# EAGLE design industrialPrototype (EAGLE 7.4.0)
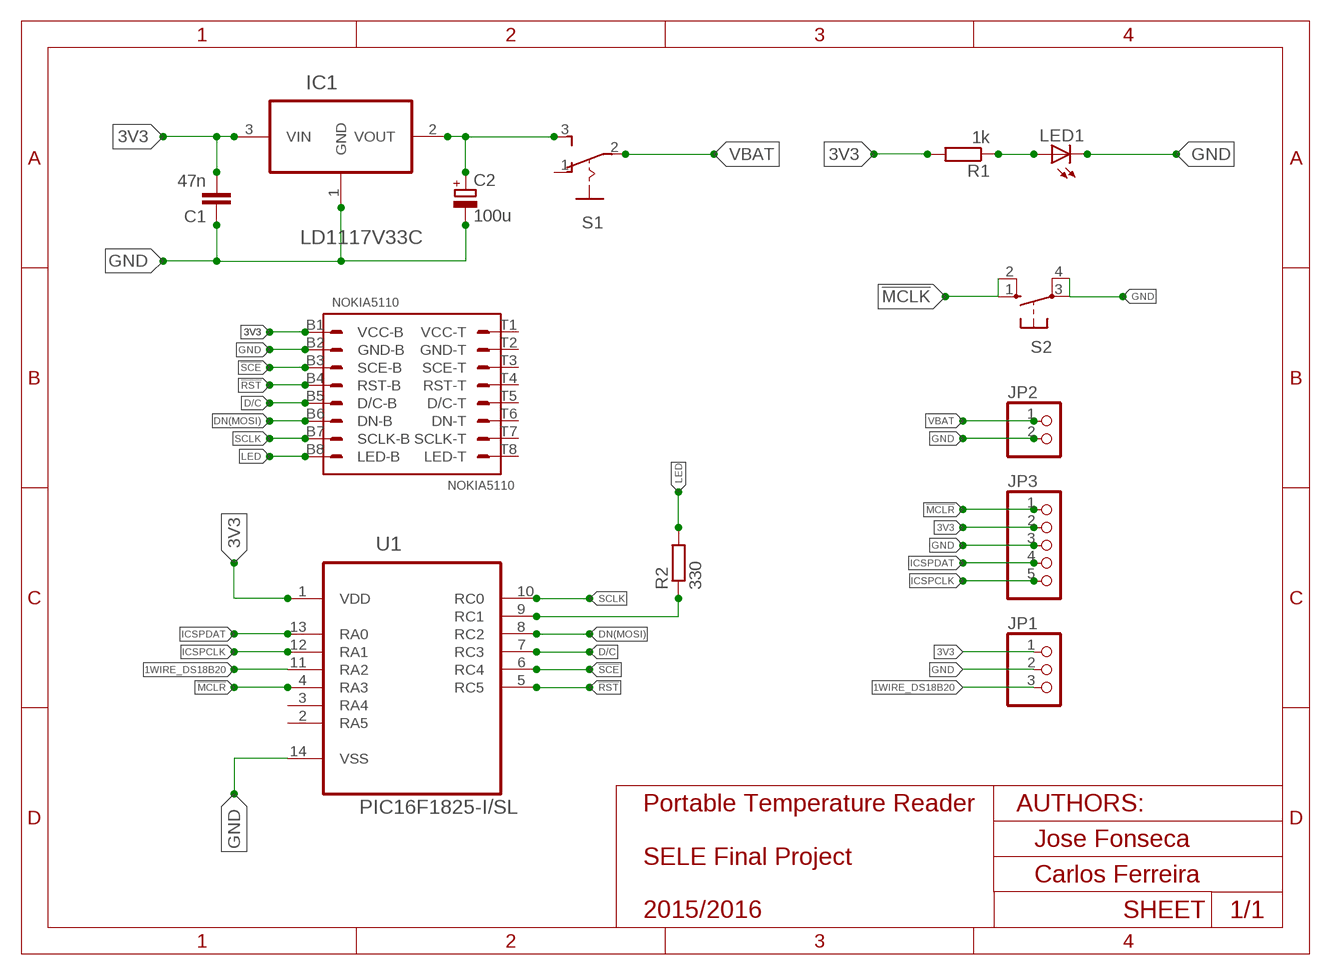
[diagram p0: schematic, sheet 1]

## Parts
C1  47n  C-EU025-025X050  [C025-025X050]
C2  100u  CPOL-EUE2.5-6  [E2,5-6]
IC1  LD1117V33C  [TO254P482X1024X3124-3P]
JP1  PINHD-1X3  [1X03]
JP2  PINHD-1X2  [1X02]
JP3  PINHD-1X5  [1X05]
LED1  LED3MM  [LED3MM]
NOKIA5110  NOKIA5110  [NOKIA5110]
R1  1k  R-EU_0204/5  [0204/5]
R2  330  R-EU_0204/5  [0204/5]
S1  255SB  [255SB]
S2  10-XX  [B3F-10XX]
U1  PIC16F1825-I/SL  [SOIC127P600X175-14N]

## Nets
1WIRE_DS18B20: JP1.3 U1.11(RA2)
3V3: C1.2 IC1.3(VIN) JP1.1 JP3.2 NOKIA5110.B1(VCC-B) R1.2 U1.1(VDD)
!MCLK!: S2.1(S) S2.2(S1)
!MCLR!: JP3.1 U1.4(RA3)
!RST!: NOKIA5110.B4(RST-B) U1.5(RC5)
!SCE!: NOKIA5110.B3(SCE-B) U1.6(RC4)
D/C: NOKIA5110.B5(D/C-B) U1.7(RC3)
DN(MOSI): NOKIA5110.B6(DN-B) U1.8(RC2)
GND: C1.1 C2.- IC1.1(GND) JP1.2 JP2.2 JP3.3 LED1.K(C) NOKIA5110.B2(GND-B) S2.3(P) S2.4(P1) U1.14(VSS)
ICSPCLK: JP3.5 U1.12(RA1)
ICSPDAT: JP3.4 U1.13(RA0)
LED: NOKIA5110.B8(LED-B) R2.2
N$1: LED1.A R1.1
N$3: R2.1 U1.9(RC1)
SCLK: NOKIA5110.B7(SCLK-B) U1.10(RC0)
VBAT: C2.+ IC1.2(VOUT) JP2.1 S1.2(P) S1.3(S)
Unconnected: NOKIA5110.T1(VCC-T) NOKIA5110.T2(GND-T) NOKIA5110.T3(SCE-T) NOKIA5110.T4(RST-T) NOKIA5110.T5(D/C-T) NOKIA5110.T6(DN-T) NOKIA5110.T7(SCLK-T) NOKIA5110.T8(LED-T) S1.1(O) U1.2(RA5) U1.3(RA4)

## Library data of the parts
C1 = rcl:C-EU: CAPACITOR, European symbol
C2 = rcl:CPOL-EU: POLARIZED CAPACITOR, European symbol
IC1 = ld1117:LD1117V33C: IC, V REG, LD1117 3.3V, TO-220-3; MPN: LD1117V33C; OC_FARNELL: 1703357; OC_NEWARK: 89K0631; PACKAGE: TO-220-3; SUPPLIER: STMicroelectronics
JP1 = pinhead:PINHD-1X3: PIN HEADER
JP2 = pinhead:PINHD-1X2: PIN HEADER
JP3 = pinhead:PINHD-1X5: PIN HEADER
LED1 = led:LED: LED OSRAM: - CHIPLED LG R971, LG N971, LY N971, LG Q971, LY Q971, LO R971, LY R971 LH N974, LH R974 LS Q976, LO Q976, LY Q976 LO Q996 - Hyper CHIPLED LW Q18S LB Q993, LB Q99A, LB R99A - SideLED LS A670, LO A670, LY A670, LG A670, LP A670 LB A673, LV A673, LT A673, LW A673 LH A674 LY A675 LS A676, LA A676, LO A676, LY A676, LW A676 LS A679, LY A679, LG A679 - Hyper Micro SIDELED® LS Y876, LA Y876, LO Y876, LY Y876 LT Y87S - SmartLED LW L88C, LW L88S LB L89C, LB L89S, LG L890 LS L89K, LO L89K, LY L89K LS L896, LA L896, LO L896, LY L896 - TOPLED LS T670, LO T670, LY T670, LG T670, LP T670 LSG T670, LSP T670, LSY T670, LOP T670, LYG T670 LG T671, LOG T671, LSG T671 LB T673, LV T673, LT T673, LW T673 LH T674 LS T676, LA T676, LO T676, LY T676, LB T676, LH T676, LSB T676, LW T676 LB T67C, LV T67C, LT T67C, LS T67K, LO T67K, LY T67K, LW E67C LS E67B, LA E67B, LO E67B, LY E67B, LB E67C, LV E67C, LT E67C LW T67C LS T679, LY T679, LG T679 LS T770, LO T770, LY T770, LG T770, LP T770 LB T773, LV T773, LT T773, LW T773 LH T774 LS E675, LA E675, LY E675, LS T675 LS T776, LA T776, LO T776, LY T776, LB T776 LHGB T686 LT T68C, LB T68C - Hyper Mini TOPLED® LB M676 - Mini TOPLED Santana® LG M470 LS M47K, LO M47K, LY M47K Source: http://www.osram.convergy.de LUXEON: - LUMILED® LXK2-PW12-R00, LXK2-PW12-S00, LXK2-PW14-U00, LXK2-PW14-V00 LXK2-PM12-R00, LXK2-PM12-S00, LXK2-PM14-U00 LXK2-PE12-Q00, LXK2-PE12-R00, LXK2-PE12-S00, LXK2-PE14-T00, LXK2-PE14-U00 LXK2-PB12-K00, LXK2-PB12-L00, LXK2-PB12-M00, LXK2-PB14-N00, LXK2-PB14-P00, LXK2-PB14-Q00 LXK2-PR12-L00, LXK2-PR12-M00, LXK2-PR14-Q00, LXK2-PR14-R00 LXK2-PD12-Q00, LXK2-PD12-R00, LXK2-PD12-S00 LXK2-PH12-R00, LXK2-PH12-S00 LXK2-PL12-P00, LXK2-PL12-Q00, LXK2-PL12-R00 Source: www.luxeon.com KINGBRIGHT: KA-3528ASYC Source: www.kingbright.com
NOKIA5110 = CustomLib:NOKIA5110
R1 R2 = resistor:R-EU_: RESISTOR, European symbol
S1 = switch:255SB: SLIDING SWITCH Distributor Buerklin, 11G810
S2 = switch-omron:10-XX: OMRON SWITCH; MPN: B3F-1000; OC_FARNELL: 176432; OC_NEWARK: 36M3542
U1 = pic16f1825:PIC16F1825-I/SL: IC, 8BIT MCU, PIC16F, 32MHz, SOIC-14; MPN: PIC16F1825-I/SL; OC_FARNELL: 1841448; OC_NEWARK: 82R4372; PACKAGE: SOIC-14; SUPPLIER: Microchip

## Board
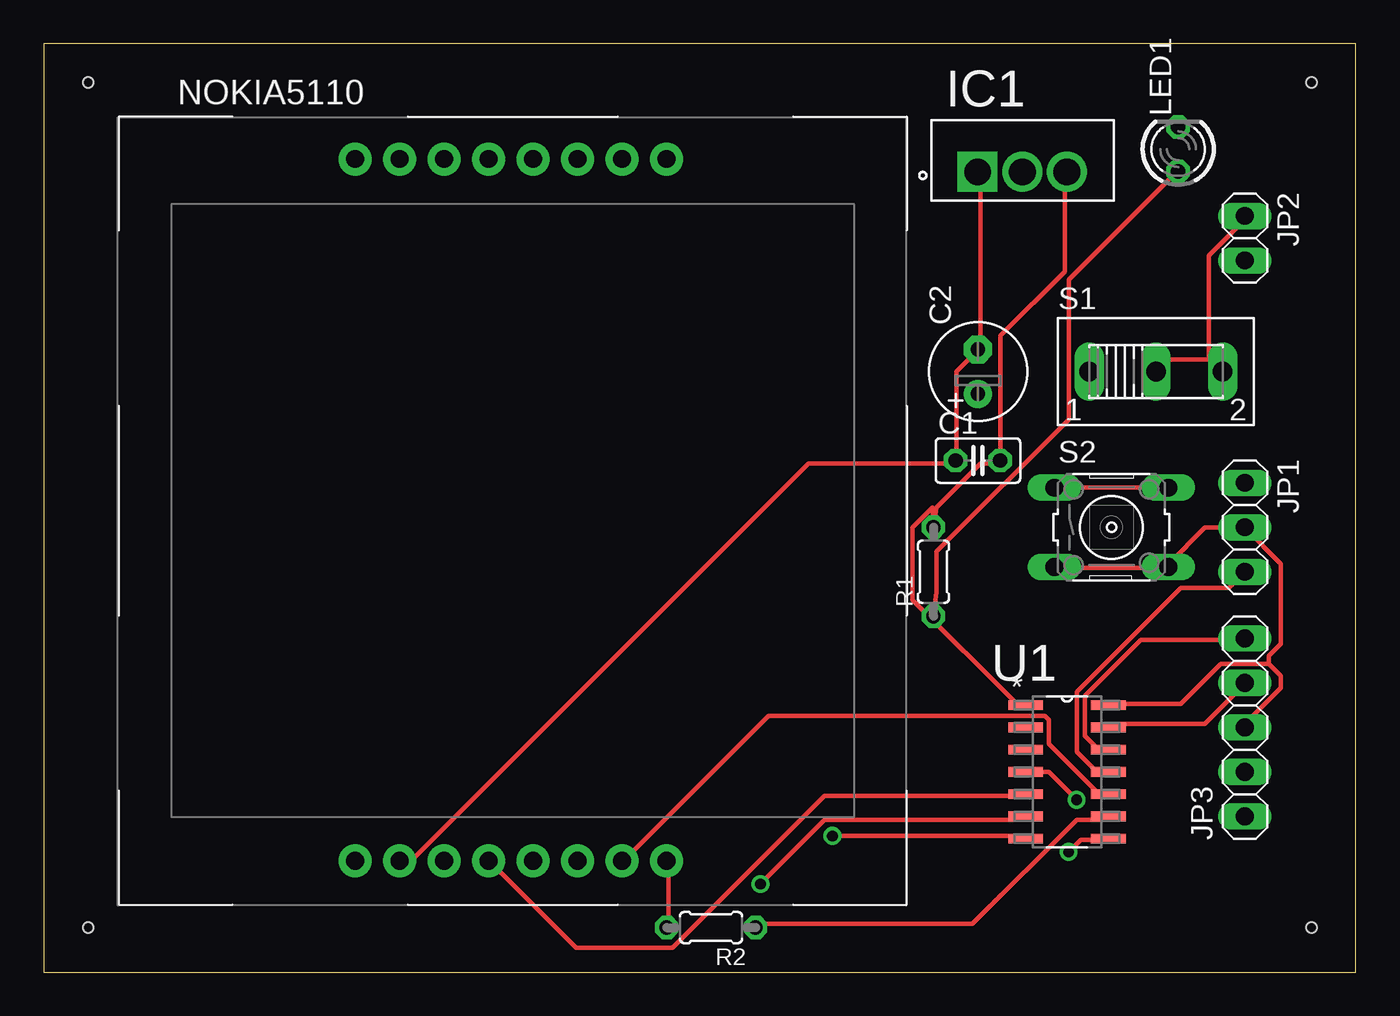
[diagram p1: board, top side]
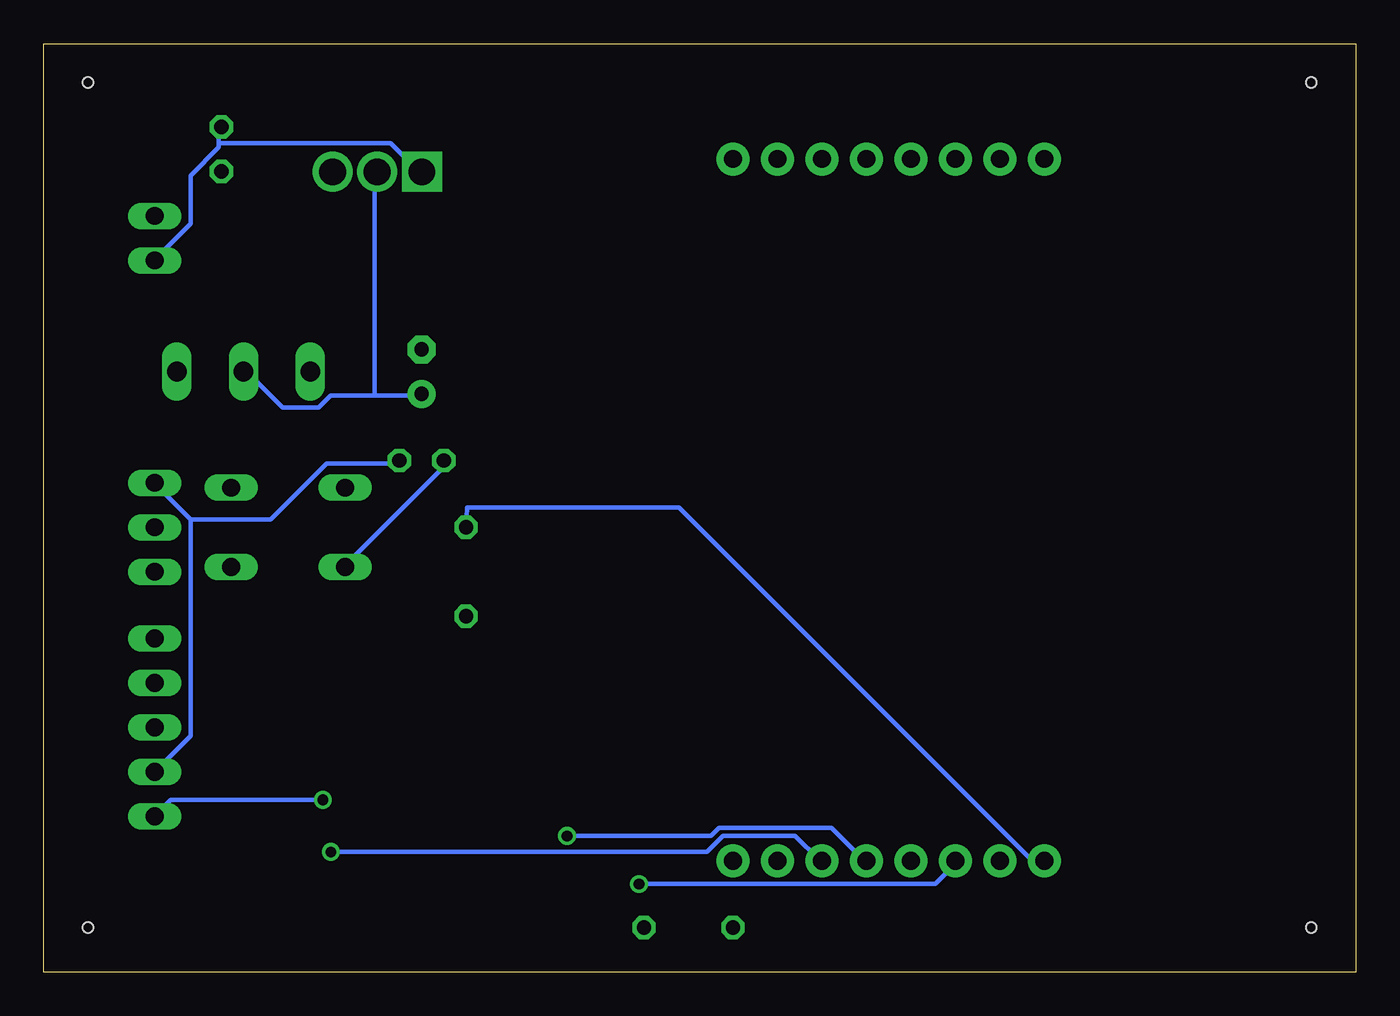
[diagram p2: board, bottom side, seen from below]

Size 74.91 x 53.01 mm. Coordinates in mm from the lower left corner, seen from the top.
Outline: 0,0 74.91,0 74.91,53.01 0,53.01 0,0
Copper layers (1*16): Top 0.035mm / dielectric 1.5mm / Bottom 0.035mm
Design rules "default": minimum track width 10mil, minimum drill 24mil, track to track 8mil, track to pad 8mil, pad to pad 8mil, via to via 8mil, smd to smd 8mil, copper to edge 40mil, drill to drill 8mil, minimum pad ring 10mil, minimum via ring 8mil, stop-mask expansion 4mil, vias tented up to drill 0mil, thermal gap 10mil
Holes 0.6 mm at 2.54,2.54 2.54,50.8 72.39,50.8 72.39,2.54

### Footprints (pad centres in the part's own frame; a part is rotated, then mirrored left to right if it is on the bottom)
C025-025X050 = drill 0.813 octagon: 1 -1.27,0; 2 1.27,0
E2,5-6 = drill 0.813 pad 1.6: + -1.27,0 | drill 0.813 pad 1.6 octagon: - 1.27,0
TO254P482X1024X3124-3P = drill 1.524 square: 1 -5.105,-1.295 | drill 1.524: 2 -2.54,-1.295; 3 0,-1.295
1X03 = drill 1.016 long: 1 -2.54,0; 2 0,0; 3 2.54,0
1X02 = drill 1.016 long: 1 -1.27,0; 2 1.27,0
1X05 = drill 1.016 long: 1 -5.08,0; 2 -2.54,0; 3 0,0; 4 2.54,0; 5 5.08,0
LED3MM = drill 0.813 octagon: A -1.27,0; K 1.27,0
NOKIA5110 = drill 1.016 pad 1.88: B1 -0.01,0; B2 2.53,0; B3 5.07,0; B4 7.61,0; B5 10.15,0; B6 12.69,0; B7 15.23,0; B8 17.77,0; T1 -0.01,40.08; T2 2.53,40.08; T3 5.07,40.08; T4 7.61,40.08; T5 10.15,40.08; T6 12.69,40.08; T7 15.23,40.08; T8 17.77,40.08
0204/5 = drill 0.813 octagon: 1 -2.54,0; 2 2.54,0
255SB = drill 1.118 long: 1 -3.81,0; 2 0,0; 3 3.81,0
B3F-10XX = drill 1.016 long: 1 -3.251,2.261; 2 3.251,2.261; 3 -3.251,-2.261; 4 3.251,-2.261
SOIC127P600X175-14N = smd 1.981 x 0.559: 1 -2.362,3.81; 2 -2.362,2.54; 3 -2.362,1.27; 4 -2.362,0; 5 -2.362,-1.27; 6 -2.362,-2.54; 7 -2.362,-3.81; 8 2.362,-3.81; 9 2.362,-2.54; 10 2.362,-1.27; 11 2.362,0; 12 2.362,1.27; 13 2.362,2.54; 14 2.362,3.81

### Placement (x,y rotation side)
C1  53.34,29.21 0 top
C2  53.34,34.29 90 top
IC1  58.42,46.99 0 top
JP1  68.58,25.4 270 top
JP2  68.58,41.91 270 top
JP3  68.58,13.97 90 top
LED1  64.77,46.99 90 top
NOKIA5110  17.78,6.35 0 top
R1  50.8,22.86 90 top
R2  38.1,2.54 180 top
S1  63.5,34.29 0 top
S2  60.96,25.4 0 top
U1  58.42,11.43 0 top

### Tracks (layer width: path | path; a pad name or v marks a point on that pad's centre or on a via)
1WIRE_DS18B20
  Top 0.254: U1.11 60.12,11.43 58.98,12.57 58.98,16 64.92,21.95 67.67,21.95 JP1.3
3V3
  Top 0.254: U1.1 56.01,15.32 55.55,15.32 49.61,21.26 49.61,25.38 50.75,26.52 R1.2 50.98,26.52 53.49,29.03 54.41,29.03 C1.2 54.63,29.26 54.63,36.35 58.29,40.01 58.29,45.49 IC1.3
  Bottom 0.254: JP3.2 66.52,13.49 66.52,25.83 | 66.52,25.83 68.58,27.89 JP1.1 | NOKIA5110.B1 17.83,6.4 18.52,6.4 38.63,26.52 50.75,26.52 R1.2 | 66.52,25.83 61.95,25.83 58.75,29.03 54.63,29.03 C1.2
!MCLK!
  Top 0.254: S2.2 S2.1
!MCLR!  (via drill 0.61)
  Top 0.254: U1.4 57.38,11.43 v58.98,9.83
  Bottom 0.254: v58.98,9.83 67.67,9.83 68.58,8.91 JP3.1
!RST!
  Top 0.254: U1.5 56.01,10.06 44.58,10.06 35.89,1.37 30.4,1.37 25.6,6.17 NOKIA5110.B4
!SCE!  (via drill 0.61)
  Top 0.254: v40.92,5.03 44.58,8.69 56.01,8.69 U1.6
  Bottom 0.254: v40.92,5.03 24,5.03 22.86,6.17 NOKIA5110.B3
D/C  (via drill 0.61)
  Top 0.254: v45.03,7.77 56.01,7.77 U1.7
  Bottom 0.254: v45.03,7.77 36.8,7.77 36.35,8.23 29.95,8.23 28.12,6.4 NOKIA5110.B5
DN(MOSI)  (via drill 0.61)
  Top 0.254: v58.52,6.86 59.21,7.54 60.58,7.54 U1.8
  Bottom 0.254: v58.52,6.86 37.03,6.86 36.12,7.77 32,7.77 30.63,6.4 NOKIA5110.B6
GND
  Top 0.254: 69.95,17.6 67.21,17.6 64.92,15.32 60.81,15.32 U1.14 | 69.95,17.6 70.64,16.92 70.64,16.23 68.58,14.17 JP3.3 | S2.3 57.84,23.09 64.01,23.09 S2.4 64.24,23.32 66.29,25.38 68.58,25.38 | 69.95,17.6 69.95,18.06 70.64,18.75 70.64,23.32 68.58,25.38 | 68.58,25.38 JP1.2 | NOKIA5110.B2 20.34,6.4 21.03,6.4 43.66,29.03 51.89,29.03 C1.1 52.12,29.26 52.12,34.29 53.26,35.43 C2.- 53.49,35.66 53.49,45.49 IC1.1
  Bottom 0.254: 64.92,47.32 64.92,47.09 66.52,45.49 66.52,42.75 68.58,40.69 JP2.2 | 64.92,47.32 64.92,48.23 LED1.K | 64.92,47.32 55.09,47.32 53.49,45.72 IC1.1 | S2.3 57.61,23.32 51.89,29.03 C1.1
ICSPCLK
  Top 0.254: U1.12 60.58,12.8 60.12,12.8 59.44,13.49 59.44,15.77 62.64,18.97 68.58,18.97 JP3.5
ICSPDAT
  Top 0.254: U1.13 60.81,14.17 66.29,14.17 68.58,16.46 JP3.4
LED
  Top 0.254: R2.2 35.66,2.74 35.66,6.17 NOKIA5110.B8
N$1
  Top 0.254: R1.1 50.98,21.72 50.98,24 58.52,31.55 58.52,39.55 64.69,45.72 LED1.A
N$3
  Top 0.254: U1.9 60.58,8.69 58.98,8.69 53.03,2.74 40.69,2.74 R2.1
SCLK
  Top 0.254: U1.10 60.58,10.29 60.12,10.29 57.38,13.03 57.38,14.4 57.15,14.63 41.38,14.63 33.15,6.4 NOKIA5110.B7
VBAT
  Top 0.254: 66.52,34.98 66.52,40.92 68.58,42.98 JP2.1 | 66.52,34.98 67.21,34.29 S1.3 66.52,34.98 | 66.52,34.98 64.24,34.98 63.55,34.29 S1.2
  Bottom 0.254: 56.01,32.92 58.52,32.92 59.21,32.23 61.27,32.23 63.32,34.29 S1.2 | 56.01,32.92 53.49,32.92 C2.+ | 56.01,32.92 56.01,45.49 IC1.2